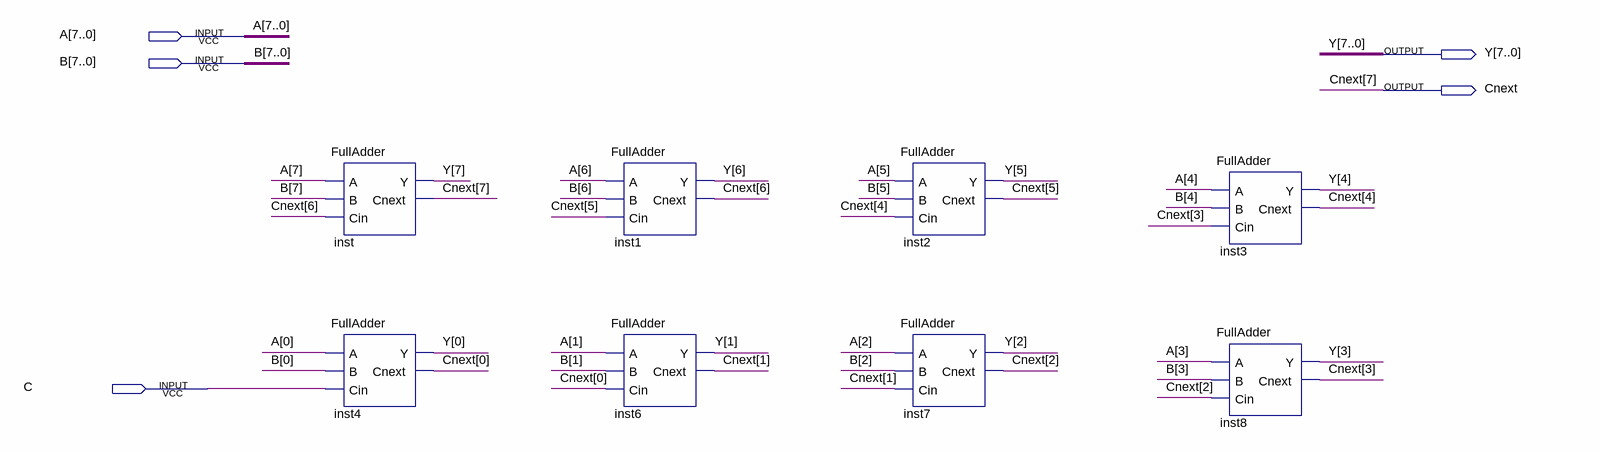
[diagram p0: schematic sheet]
// Quartus schematic Adder8bit.bdf as structural Verilog: 8 symbols, 5 pins
module Adder8bit (
  input  [7:0] A,
  input  [7:0] B,
  input  C,
  output [7:0] Y,
  output Cnext
);

  wire [6:0] Cnext_bus;

  FullAdder inst (.A(A[7]), .B(B[7]), .Cin(Cnext_bus[6]), .Y(Y[7]), .Cnext(Cnext));
  FullAdder inst4 (.A(A[0]), .B(B[0]), .Cin(C), .Y(Y[0]), .Cnext(Cnext_bus[0]));
  FullAdder inst1 (.A(A[6]), .B(B[6]), .Cin(Cnext_bus[5]), .Y(Y[6]), .Cnext(Cnext_bus[6]));
  FullAdder inst6 (.A(A[1]), .B(B[1]), .Cin(Cnext_bus[0]), .Y(Y[1]), .Cnext(Cnext_bus[1]));
  FullAdder inst2 (.A(A[5]), .B(B[5]), .Cin(Cnext_bus[4]), .Y(Y[5]), .Cnext(Cnext_bus[5]));
  FullAdder inst7 (.A(A[2]), .B(B[2]), .Cin(Cnext_bus[1]), .Y(Y[2]), .Cnext(Cnext_bus[2]));
  FullAdder inst3 (.A(A[4]), .B(B[4]), .Cin(Cnext_bus[3]), .Y(Y[4]), .Cnext(Cnext_bus[4]));
  FullAdder inst8 (.A(A[3]), .B(B[3]), .Cin(Cnext_bus[2]), .Y(Y[3]), .Cnext(Cnext_bus[3]));

  // Other names for the same wires on the sheet: Cnext[7] = Cnext
endmodule
